# Altium schematic sheet ENC28J60.SchDoc
size A; SheetNumber: 2; SheetTotal: 5
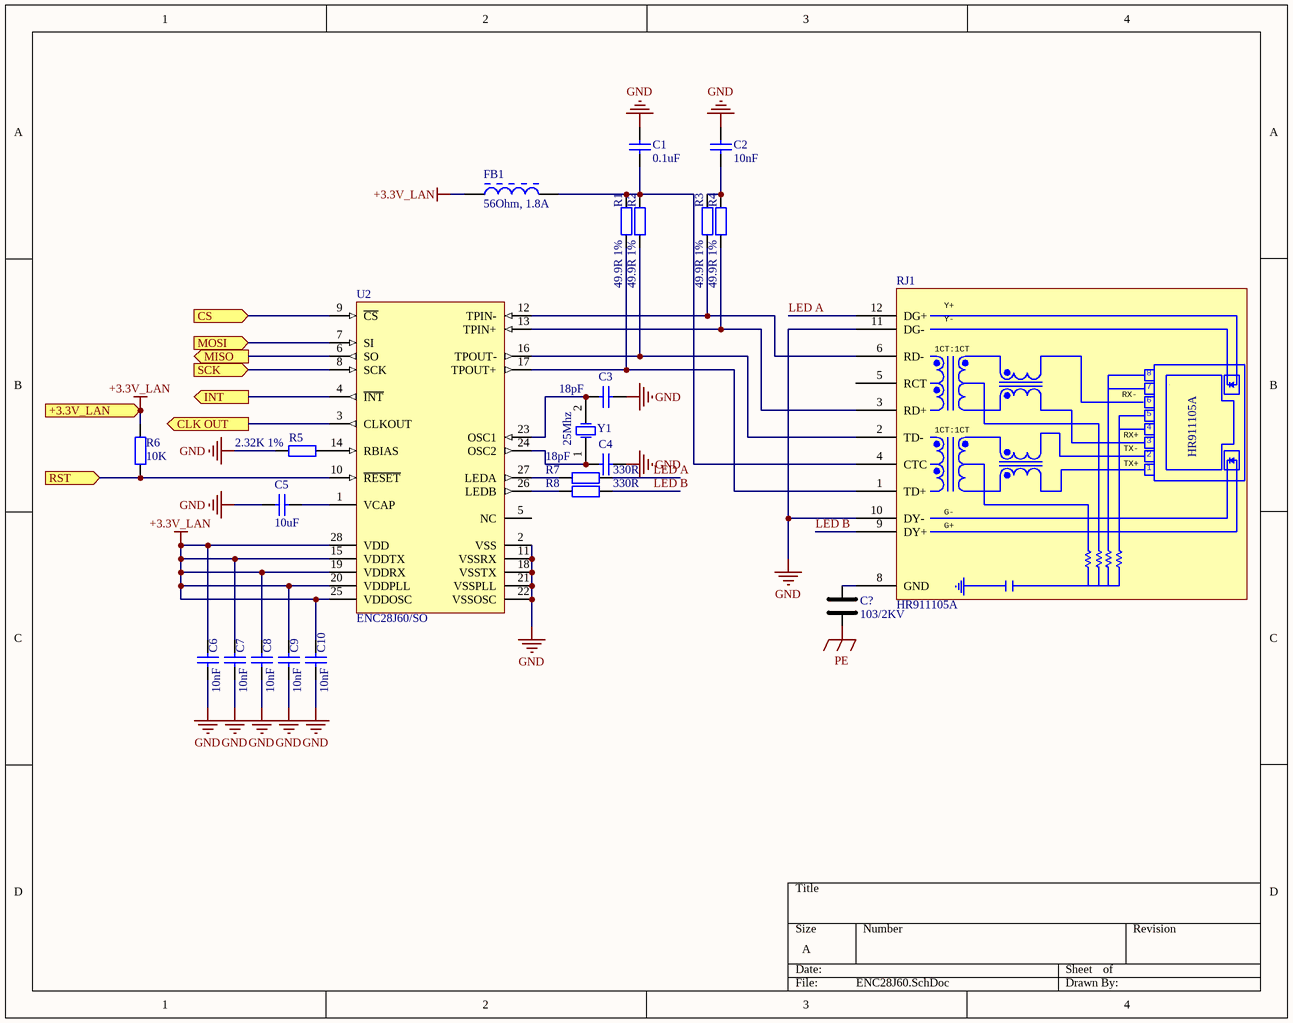
[diagram p0: ENC28J60.SchDoc]

## Parts
C1  0.1uF  [CAP_0603]
C2  10nF  [CAP_0603]
C3  18pF  [CAP_0603]
C4  18pF  [CAP_0603]
C5  10uF  [CAP_0805]
C6  10nF  [CAP_0603]
C7  10nF  [CAP_0603]
C8  10nF  [CAP_0603]
C9  10nF  [CAP_0603]
C10  10nF  [CAP_0603]
C?  103/2KV  [103/2KV]
FB1  56Ohm, 1.8A  [WE-CBF_0805_Wide Band]
R1  49.9R 1%  [RES_0603]
R2  49.9R 1%  [RES_0603]
R3  49.9R 1%  [RES_0603]
R4  49.9R 1%  [RES_0603]
R5  2.32K 1%  [RES_0603]
R6  10K  [RES_0603]
R7  330R  [RES_0603]
R8  330R  [RES_0603]
RJ1  HR911105A  [HR911105A]
U2  ENC28J60/SO  [SSOP-28]
Y1  25Mhz  [WE-XTAL_HC49/4H]

## Ports
+3.3V_LAN (in), CLK OUT (out), CS (in), INT (out), MISO (out), MOSI (in), RST (in), SCK (in)

## Nets
+3.3V_LAN: C6.1 C7.1 C8.1 C9.1 C10.1 FB1.1 R6.1 U2.15(VDDTX) U2.19(VDDRX) U2.20(VDDPLL) U2.25(VDDOSC) U2.28(VDD) ; port +3.3V_LAN
GND: C1.1 C2.1 C3.2 C4.2 C5.2 C6.2 C7.2 C8.2 C9.2 C10.2 R5.2 RJ1.10(DY-) RJ1.11(DG-) U2.2(VSS) U2.11(VSSRX) U2.18(VSSTX) U2.21(VSSPLL) U2.22(VSSOSC)
PE: C?.1
CLK OUT: U2.3(CLKOUT) ; port CLK OUT
CS: U2.9(~{CS}) ; port CS
INT: U2.4(~{INT}) ; port INT
LED A: R7.1 RJ1.12(DG+)
LED B: R8.1 RJ1.9(DY+)
MISO: U2.6(SO) ; port MISO
MOSI: U2.7(SI) ; port MOSI
RST: R6.2 U2.10(~{RESET}) ; port RST
SCK: U2.8(SCK) ; port SCK
NetC1_2: C1.2 FB1.2 R1.2 R2.2 RJ1.4(CTC)
NetC2_2: C2.2 R3.2 R4.2
NetC3_1: C3.1 U2.23(OSC1) Y1.2(OSC2)
NetC4_1: C4.1 U2.24(OSC2) Y1.1(OSC1)
NetC5_1: C5.1 U2.1(VCAP)
NetC?_2: C?.2 RJ1.8(GND)
NetR1_1: R1.1 RJ1.1(TD+) U2.17(TPOUT+)
NetR2_1: R2.1 RJ1.2(TD-) U2.16(TPOUT-)
NetR3_1: R3.1 RJ1.6(RD-) U2.12(TPIN-)
NetR4_1: R4.1 RJ1.3(RD+) U2.13(TPIN+)
NetR5_1: R5.1 U2.14(RBIAS)
NetR7_2: R7.2 U2.27(LEDA)
NetR8_2: R8.2 U2.26(LEDB)

Not connected (* = marked no-connect by the designer): RJ1 5(RCT); U2 5(NC)

## Notes on the sheet
- (in symbol HR911105A) Y+; Y-; 1CT:1CT; 7; RX-; RX+; TX-; TX+; G-; G+

## Library data of the parts
C1-C10 = CAP_SMD: WCAP-CSGP General Purpose Ceramic Capacitors; Part Number: 885012005001; Rated Voltage: 10VDC; Isolation Resistance: >=10GOhm; Ceramic Type: NP0; Capacitance Tolerance: +/-0.5pF; Dissipation Factor: Q>=400+20C; Capacitance: 1pF; Technical Reference: NP004021R0D010DFCT10000; ComponentLink1Description: Manufacturer; ComponentLink1URL: http://www.we-online.de; ComponentLink2Description: Datasheet; ComponentLink2URL: https://katalog.we-online.com/pbs/datasheet/885012005001.pdf; Operating Temperature: -55 to +125degC; Packaging: Tape and Reel; Publisher: Wurth Elektronik; Published Date: August 2019; Height: 0.5mm +/-0.05mm; Mounting Technology: SMT; Size: 0402
FB1 = 742792015: WE-CBF SMT EMI Suppression Ferrite Bead, size 0805, 56Ohm, 1.8A; Manufacturer: Wurth Elektronik; Impedance max.: 230Ohm; DC Resistance max.: 0.3Ohm; Type: Wide Band; ComponentLink1Description: Manufacturer; ComponentLink1URL: http://www.we-online.de; ComponentLink2Description: Datasheet; ComponentLink2URL: https://www.we-online.com/catalog/datasheet/742792015.pdf; Operating Temperature: -55 to +125degC; Packaging: Tape and Reel; Published Date: December 2021; Rated Current: 1.8A; Manufacturer Part Number: 742792015; Impedance @100MHz: 56Ohm; Mounting Technology: SMT; Size: 0805; Height: 0.9mm; Length: 2mm; Width: 1.2mm
R1-R8 = RES_SMD: WRIS-KSKE SMT Thick Film Resistor, 0.125W; Manufacturer: Wurth Elektronik; Manufacturer Part Number: 560050310010; Rated Current: 0.5A; Resistance: 0.5Ohm; Temperature Coefficient of Resistance: 200ppm/degC; Technical Reference: KE0402R500F108HAATH0000; Resistance Tolerance: +/-1%; ComponentLink1Description: Manufacturer; ComponentLink1URL: http://www.we-online.de; ComponentLink2Description: Datasheet; ComponentLink2URL: https://www.we-online.com/catalog/datasheet/560050310010.pdf; Published Date: May 2020; Rated Power: 0.125W; Height: 0.35mm; Operating Temperature: -55 to +155degC; Mounting Technology: SMT; Packaging: Tape and Reel; Size: 0402; Length: 1mm; Width: 0.5mm
RJ1 = HR911105A: Single port RJ45 with intergreated magnetics and LED
U2 = ENC28J60/SO: Stand-Alone Ethernet Controller with SPI Interface, 28-Pin SOIC; ComponentLink1Description: Manufacturer URL; ComponentLink2Description: Datasheet; ComponentLink3Description: Package Specification; ComponentLink3URL: http://www.microchip.com/stellent/groups/techpub_sg/documents/packagingspec/en012702.pdf; DatasheetVersion: revC, Jan-2008; ComponentLink1URL: http://www.microchip.com/; Code_JEDEC: MS-013; RevisionNote: URLs added.; PackageVersion: revBB, Aug-2009; PackageDescription: 28-Lead Plastic Small Outline (SO) - Wide 7.50mm Body [SOIC]; ComponentLink2URL: http://ww1.microchip.com/downloads/en/DeviceDoc/39662c.pdf; PackageReference: SOIC-SO28; PartNumber: ENC28J60/SO
Y1 = 830014948B: WE-XTAL Quartz Crystal, THT, HC49/4H, 27.12MHz, +/-30ppm; Manufacturer: Wurth Elektronik; Frequency Stability: +/-50ppm; Load Capacitance: Series Resonant; ComponentLink1Description: Manufacturer; ComponentLink1URL: http://www.we-online.de; ComponentLink2Description: Datasheet; ComponentLink2URL: https://katalog.we-online.com/pbs/datasheet/830014948B.pdf; Operating Temperature: -10 to +60degC; Packaging: Bulk; Manufacturer Part Number: 830014948B; Published Date: July 2020; Size: HC49/4H; Frequency: 27.12MHz; Frequency Tolerance: +/-30ppm; Mounting Technology: THT